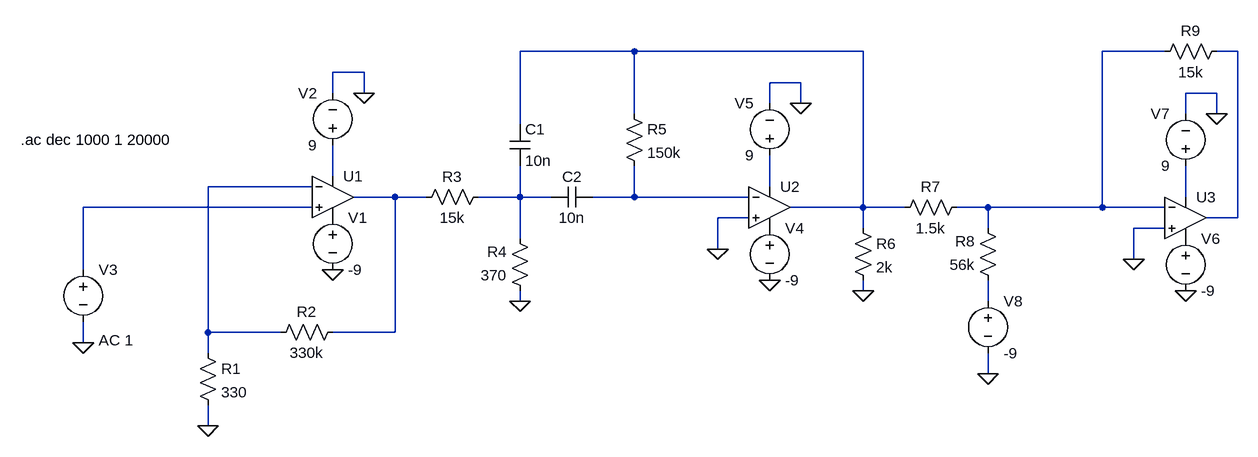
[diagram p0: schematic gain_simulation.asc]
gain_simulation.asc, the LTspice schematic file:
Version 4
SHEET 1 1556 680
WIRE 624 -112 448 -112
WIRE 976 -112 624 -112
WIRE 1440 -112 1344 -112
WIRE 1552 -112 1520 -112
WIRE 208 -80 160 -80
WIRE 880 -64 832 -64
WIRE 160 -48 160 -80
WIRE 208 -48 208 -80
WIRE 1520 -48 1472 -48
WIRE 832 -32 832 -64
WIRE 880 -32 880 -64
WIRE 624 -16 624 -112
WIRE 1472 -16 1472 -48
WIRE 1520 -16 1520 -48
WIRE 448 0 448 -112
WIRE 160 80 160 32
WIRE 128 96 -32 96
WIRE 832 96 832 48
WIRE 256 112 192 112
WIRE 304 112 256 112
WIRE 448 112 448 64
WIRE 448 112 384 112
WIRE 496 112 448 112
WIRE 624 112 624 64
WIRE 624 112 560 112
WIRE 800 112 624 112
WIRE 1472 112 1472 64
WIRE 128 128 -224 128
WIRE 976 128 976 -112
WIRE 976 128 864 128
WIRE 1040 128 976 128
WIRE 1168 128 1120 128
WIRE 1344 128 1344 -112
WIRE 1344 128 1168 128
WIRE 1440 128 1344 128
WIRE 800 144 752 144
WIRE 1552 144 1552 -112
WIRE 1552 144 1504 144
WIRE 976 160 976 128
WIRE 1168 160 1168 128
WIRE 1440 160 1392 160
WIRE 448 176 448 112
WIRE 752 192 752 144
WIRE 1392 208 1392 160
WIRE -224 224 -224 128
WIRE 976 256 976 240
WIRE 448 272 448 256
WIRE 1168 272 1168 240
WIRE -32 320 -32 96
WIRE 80 320 -32 320
WIRE 256 320 256 112
WIRE 256 320 160 320
WIRE -224 336 -224 304
WIRE -32 352 -32 320
WIRE 1168 384 1168 352
WIRE -32 464 -32 432
FLAG -32 464 0
FLAG 160 224 0
FLAG 208 -48 0
FLAG -224 336 0
FLAG 448 272 0
FLAG 832 240 0
FLAG 880 -32 0
FLAG 752 192 0
FLAG 1472 256 0
FLAG 1520 -16 0
FLAG 1392 208 0
FLAG 1168 384 0
FLAG 976 256 0
SYMBOL OpAmps\\UniversalOpamp2 160 112 R0
SYMATTR InstName U1
SYMBOL res -48 336 R0
SYMATTR InstName R1
SYMATTR Value 330
SYMBOL res 176 304 R90
WINDOW 0 0 56 VBottom 2
WINDOW 3 32 56 VTop 2
SYMATTR InstName R2
SYMATTR Value 330k
SYMBOL voltage 160 128 R0
WINDOW 123 0 0 Left 0
WINDOW 39 0 0 Left 0
SYMATTR InstName V1
SYMATTR Value -9
SYMBOL voltage 160 48 R180
WINDOW 0 24 96 Left 2
WINDOW 3 24 16 Left 2
WINDOW 123 0 0 Left 0
WINDOW 39 0 0 Left 0
SYMATTR InstName V2
SYMATTR Value 9
SYMBOL voltage -224 208 R0
WINDOW 123 24 124 Left 2
WINDOW 39 0 0 Left 0
SYMATTR InstName V3
SYMATTR Value ""
SYMATTR Value2 AC 1
SYMBOL res 400 96 R90
WINDOW 0 0 56 VBottom 2
WINDOW 3 32 56 VTop 2
SYMATTR InstName R3
SYMATTR Value 15k
SYMBOL res 464 272 R180
WINDOW 0 36 76 Left 2
WINDOW 3 36 40 Left 2
SYMATTR InstName R4
SYMATTR Value 370
SYMBOL cap 432 0 R0
SYMATTR InstName C1
SYMATTR Value 10n
SYMBOL cap 560 96 R90
WINDOW 0 0 32 VBottom 2
WINDOW 3 32 32 VTop 2
SYMATTR InstName C2
SYMATTR Value 10n
SYMBOL res 608 -32 R0
SYMATTR InstName R5
SYMATTR Value 150k
SYMBOL OpAmps\\UniversalOpamp2 832 128 R0
SYMATTR InstName U2
SYMBOL voltage 832 144 R0
WINDOW 123 0 0 Left 0
WINDOW 39 0 0 Left 0
SYMATTR InstName V4
SYMATTR Value -9
SYMBOL voltage 832 64 R180
WINDOW 0 24 96 Left 2
WINDOW 3 24 16 Left 2
WINDOW 123 0 0 Left 0
WINDOW 39 0 0 Left 0
SYMATTR InstName V5
SYMATTR Value 9
SYMBOL OpAmps\\UniversalOpamp2 1472 144 R0
SYMATTR InstName U3
SYMBOL voltage 1472 160 R0
WINDOW 123 0 0 Left 0
WINDOW 39 0 0 Left 0
SYMATTR InstName V6
SYMATTR Value -9
SYMBOL voltage 1472 80 R180
WINDOW 0 24 96 Left 2
WINDOW 3 24 16 Left 2
WINDOW 123 0 0 Left 0
WINDOW 39 0 0 Left 0
SYMATTR InstName V7
SYMATTR Value 9
SYMBOL res 960 144 R0
SYMATTR InstName R6
SYMATTR Value 2k
SYMBOL res 1136 112 R90
WINDOW 0 0 56 VBottom 2
WINDOW 3 32 56 VTop 2
SYMATTR InstName R7
SYMATTR Value 1.5k
SYMBOL res 1184 256 R180
WINDOW 0 36 76 Left 2
WINDOW 3 36 40 Left 2
SYMATTR InstName R8
SYMATTR Value 56k
SYMBOL voltage 1168 256 R0
WINDOW 123 0 0 Left 0
WINDOW 39 0 0 Left 0
SYMATTR InstName V8
SYMATTR Value -9
SYMBOL res 1536 -128 R90
WINDOW 0 0 56 VBottom 2
WINDOW 3 32 56 VTop 2
SYMATTR InstName R9
SYMATTR Value 15k
TEXT -320 24 Left 2 !.ac dec 1000 1 20000

The netlist it stands for:
* gain_simulation.asc
XU1 N011 N005 N004 P001 N007 level.2 Avol=1Meg GBW=10Meg Slew=10Meg ilimit=25m rail=0 Vos=0 phimargin=45 en=0 enk=0 in=0 ink=0 Rin=500Meg  ; pins IN+ IN- V+ V- OUT
R1 N005 0 330
R2 N007 N005 330k
V1 P001 0 -9
V2 N004 0 9
V3 N011 0 AC 1
R3 N008 N007 15k
R4 0 N008 370
C1 N001 N008 10n
C2 N009 N008 10n
R5 N001 N009 150k
XU2 0 N009 N006 P002 N001 level.2 Avol=1Meg GBW=10Meg Slew=10Meg ilimit=25m rail=0 Vos=0 phimargin=45 en=0 enk=0 in=0 ink=0 Rin=500Meg  ; pins IN+ IN- V+ V- OUT
V4 P002 0 -9
V5 N006 0 9
XU3 0 N002 N010 P003 N003 level.2 Avol=1Meg GBW=10Meg Slew=10Meg ilimit=25m rail=0 Vos=0 phimargin=45 en=0 enk=0 in=0 ink=0 Rin=500Meg  ; pins IN+ IN- V+ V- OUT
V6 P003 0 -9
V7 N010 0 9
R6 N001 0 2k
R7 N002 N001 1.5k
R8 N012 N002 56k
V8 N012 0 -9
R9 N003 N002 15k
.ac dec 1000 1 20000
.lib UniversalOpamps2.sub
.backanno
.end